# Altium schematic sheet relays.SchDoc
size A4
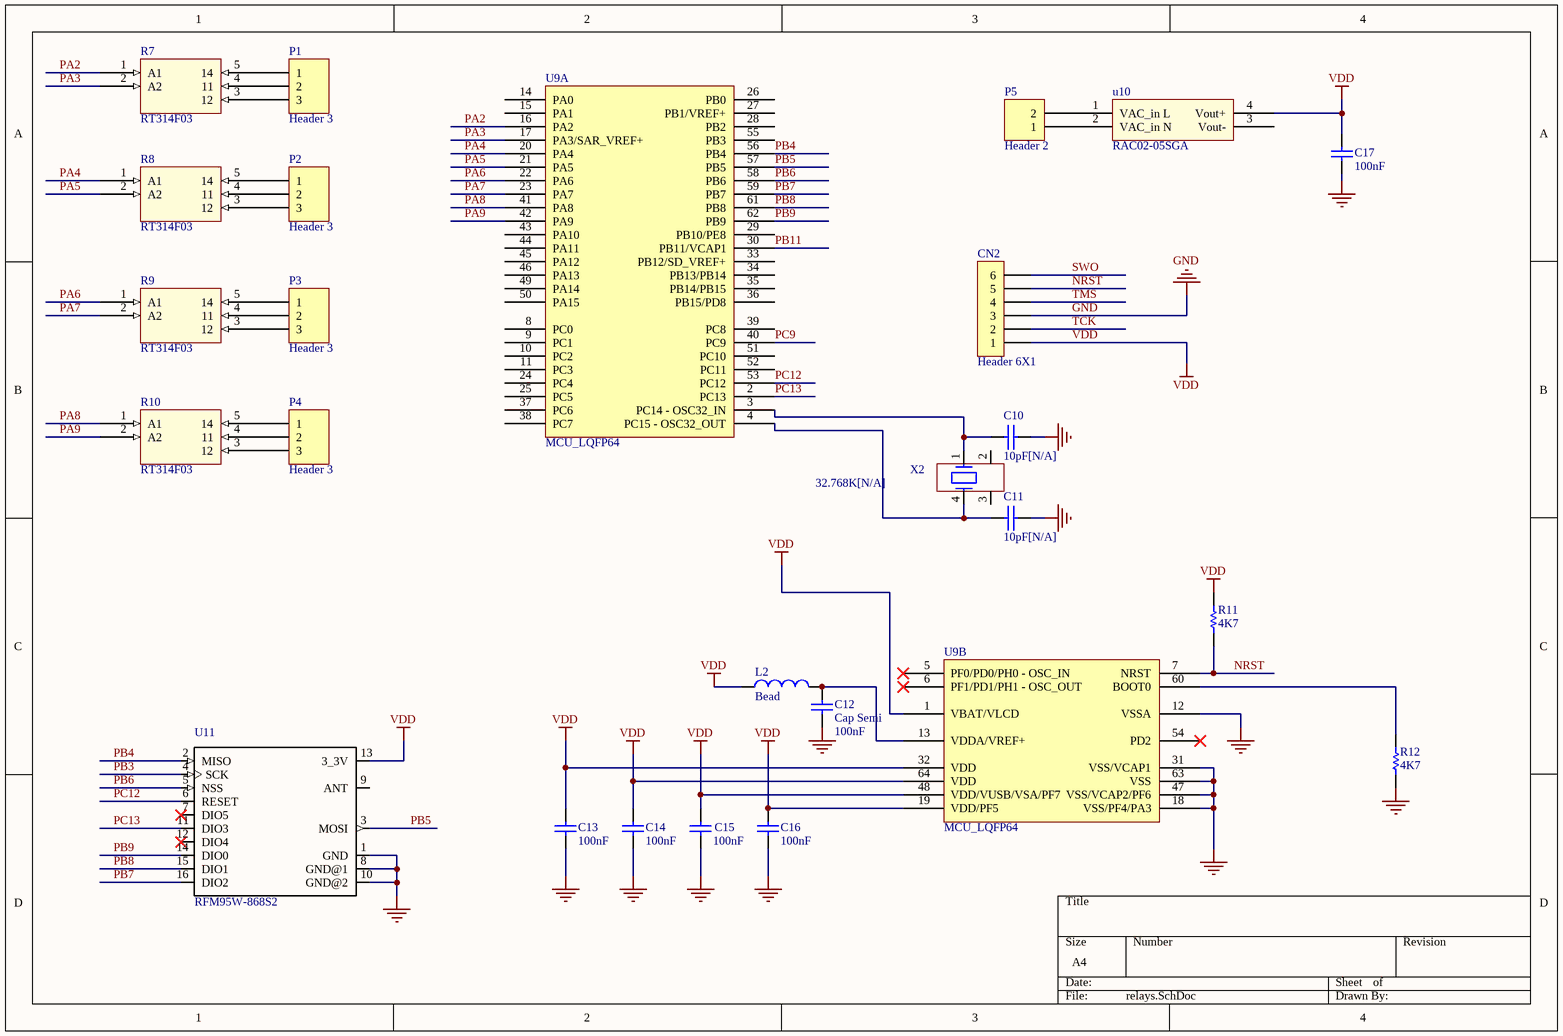
[diagram p0: relays.SchDoc]

## Parts
C10  10pF[N/A]  [0603C]
C11  10pF[N/A]  [0603C]
C12  Cap Semi  value 100nF  [1608[0603]]
C13  100nF  [0603C]
C14  100nF  [0603C]
C15  100nF  [0603C]
C16  100nF  [0603C]
C17  100nF  [0603C]
CN2  Header 6X1  [1*6P]
L2  Bead  [INDC1608L]
P1  Header 3  [HDR1X3]
P2  Header 3  [HDR1X3]
P3  Header 3  [HDR1X3]
P4  Header 3  [HDR1X3]
P5  Header 2  [HDR1X2]
R7  RT314F03  [RT314F03]
R8  RT314F03  [RT314F03]
R9  RT314F03  [RT314F03]
R10  RT314F03  [RT314F03]
R11  4K7  [0603R]
R12  4K7  [0603R]
U9  MCU_LQFP64  [LQFP64]  (parts A,B of 2)
u10  RAC02-05SGA
U11  RFM95W-868S2  [XCVR_RFM95W-868S2]
X2  32.768K[N/A]  [XTAL_4SM_8X3R8]

## Nets
GND: C10.2 C11.2 C12.2 C13.2 C14.2 C15.2 C16.2 C17.2 CN2.3 R12.1 U9.12(VSSA) U9.18(VSS/PF4/PA3) U9.31(VSS/VCAP1) U9.47(VSS/VCAP2/PF6) U9.63(VSS) U11.1(GND) U11.8(GND@1) U11.10(GND@2)
VDD: C13.1 C14.1 C15.1 C16.1 C17.1 CN2.1 L2.1 R11.2 U9.1(VBAT/VLCD) U9.19(VDD/PF5) U9.32(VDD) U9.48(VDD/VUSB/VSA/PF7) U9.64(VDD) u10.4(Vout+) U11.13(3_3V)
NRST: CN2.5 R11.1 U9.7(NRST)
PA2: R7.1(A1) U9.16(PA2)
PA3: R7.2(A2) U9.17(PA3/SAR_VREF+)
PA4: R8.1(A1) U9.20(PA4)
PA5: R8.2(A2) U9.21(PA5)
PA6: R9.1(A1) U9.22(PA6)
PA7: R9.2(A2) U9.23(PA7)
PA8: R10.1(A1) U9.41(PA8)
PA9: R10.2(A2) U9.42(PA9)
PB3: U11.4(SCK)
PB4: U9.56(PB4) U11.2(MISO)
PB5: U9.57(PB5) U11.3(MOSI)
PB6: U9.58(PB6) U11.5(NSS)
PB7: U9.59(PB7) U11.16(DIO2)
PB8: U9.61(PB8) U11.15(DIO1)
PB9: U9.62(PB9) U11.14(DIO0)
PB11: U9.30(PB11/VCAP1)
PC9: U9.40(PC9)
PC12: U9.53(PC12) U11.6(RESET)
PC13: U9.2(PC13) U11.11(DIO3)
SWO: CN2.6
TCK: CN2.2
TMS: CN2.4
NetC10_1: C10.1 U9.3(PC14_-_OSC32_IN) X2.1
NetC11_1: C11.1 U9.4(PC15_-_OSC32_OUT) X2.4
NetC12_1: C12.1 L2.2 U9.13(VDDA/VREF+)
NetP1_1: P1.1 R7.5(14)
NetP1_2: P1.2 R7.4(11)
NetP1_3: P1.3 R7.3(12)
NetP2_1: P2.1 R8.5(14)
NetP2_2: P2.2 R8.4(11)
NetP2_3: P2.3 R8.3(12)
NetP3_1: P3.1 R9.5(14)
NetP3_2: P3.2 R9.4(11)
NetP3_3: P3.3 R9.3(12)
NetP4_1: P4.1 R10.5(14)
NetP4_2: P4.2 R10.4(11)
NetP4_3: P4.3 R10.3(12)
NetP5_1: P5.1 u10.2(VAC_in_N)
NetP5_2: P5.2 u10.1(VAC_in_L)
NetR12_2: R12.2 U9.60(BOOT0)

Not connected (* = marked no-connect by the designer): U9 5(PF0/PD0/PH0_-_OSC_IN)* 6(PF1/PD1/PH1_-_OSC_OUT)* 8(PC0) 9(PC1) 10(PC2) 11(PC3) 14(PA0) 15(PA1) 24(PC4) 25(PC5) 26(PB0) 27(PB1/VREF+) 28(PB2) 29(PB10/PE8) 33(PB12/SD_VREF+) 34(PB13/PB14) 35(PB14/PB15) 36(PB15/PD8) 37(PC6) 38(PC7) 39(PC8) 43(PA10) 44(PA11) 45(PA12) 46(PA13) 49(PA14) 50(PA15) 51(PC10) 52(PC11) 54(PD2)* 55(PB3); u10 3(Vout-); U11 7(DIO5)* 9(ANT) 12(DIO4)*; X2 2 3

## Library data of the parts
C10 = Cap: Capacitor
C11 = CAP: Capacitor
C12 = Cap Semi: Capacitor (Semiconductor SIM Model); Published: 8-Jun-2000; LatestRevisionDate: 29-May-2009; LatestRevisionNote: IPC-7351 Footprint Added.; PackageReference: C1206; Publisher: Altium Limited; PackageDescription: Chip Capacitor
C13-C17 = Cap: Capacitor; Value: 10nF; Published: 8-Jun-2000; Revision: July-2002: Re-released for DXP Platform.; Publisher: Altium Limited
CN2 = Header 6X1: Header, 6-Pin, Single row; LatestRevisionDate: 17-Jul-2002; LatestRevisionNote: Re-released for DXP Platform.; Publisher: Altium Limited
L2 = Inductor: Code_IEC: 1005; Value: 10mH; Published: 8-Jun-2000; LatestRevisionDate: 29-May-2009; LatestRevisionNote: IPC-7351 Footprint Added.; PackageReference: 0402-A; Publisher: Altium Limited; PackageDescription: Chip Inductor; Code_JEITA: 0402
P1-P4 = Header 3: Header, 3-Pin; LatestRevisionDate: 17-Jul-2002; LatestRevisionNote: Re-released for DXP Platform.; Publisher: Altium Limited
P5 = Header 2: Header, 2-Pin; LatestRevisionDate: 17-Jul-2002; LatestRevisionNote: Re-released for DXP Platform.; Publisher: Altium Limited
R7-R10 = RT314F03: Latching relay
R11 R12 = Res1: Resistor; Value: 1K; Published: 8-Jun-2000; Publisher: Altium Limited; Revision: July-2002: Re-released for DXP Platform.
u10 = RAC02-05SGA: AC/DC converter
U11 = RFM95W-868S2: MF: Hope Microelectronics; MP: RFM95W-868S2; Availability: Warning; Price: 8.44 USD; Package: SMD-16 Hope Microelectronics; Value: *
X2 = MC306